# Altium project PCB_Project1.PrjPCB
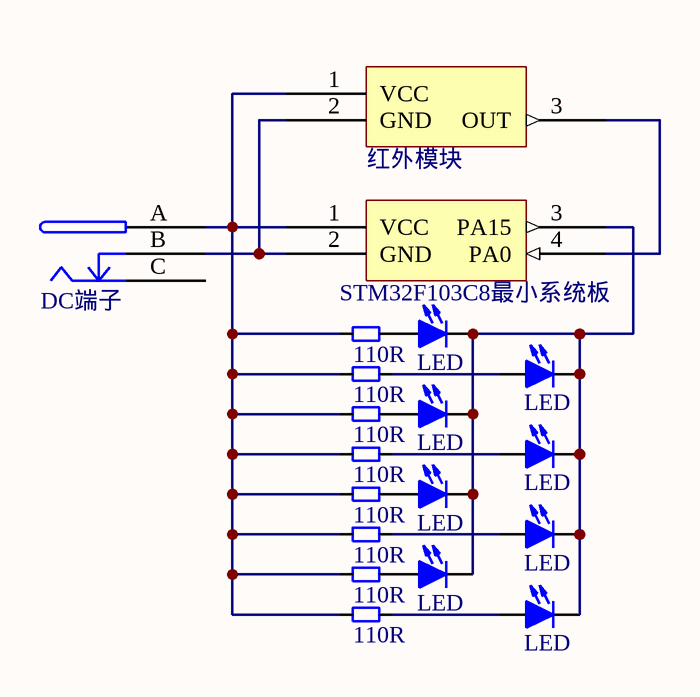
[diagram p0: Sheet1.SchDoc]
1 sheet, 19 parts. Net scope: global (net labels, ports and power ports of the same name join across sheets).

## Sheet Sheet1.SchDoc
size A4

### Parts
(Parts that share a designator on the sheet are numbered #1, #2 ... from top to bottom, then left to right.)
#1  红外模块
#2  STM32F103C8最小系统板
?#1  DC端子
?#2  110R
?#3  LED  [3mmLED白色]
?#4  110R
?#5  LED  [3mmLED白色]
?#6  110R
?#7  LED  [3mmLED白色]
?#8  110R
?#9  LED  [3mmLED白色]
?#10  110R
?#11  LED  [3mmLED白色]
?#12  110R
?#13  LED  [3mmLED白色]
?#14  110R
?#15  LED  [3mmLED白色]
?#16  110R
?#17  LED  [3mmLED白色]

### Nets
Net#1_1: #1.1(VCC) #2.1(VCC) ?#1.A ?#2.?1 ?#4.?1 ?#6.?1 ?#8.?1 ?#10.?1 ?#12.?1 ?#14.?1 ?#16.?1
Net#1_2: #1.2(GND) #2.2(GND) ?#1.B
Net#1_3: #1.3(OUT) #2.4(PA0)
Net#2_3: #2.3(PA15) ?#3.2(K) ?#5.2(K) ?#7.2(K) ?#9.2(K) ?#11.2(K) ?#13.2(K) ?#15.2(K) ?#17.2(K)
Net?#2_?2: ?#2.?2 ?#3.1(A)
Net?#4_?2: ?#4.?2 ?#5.1(A)
Net?#6_?2: ?#6.?2 ?#7.1(A)
Net?#8_?2: ?#8.?2 ?#9.1(A)
Net?#10_?2: ?#10.?2 ?#11.1(A)
Net?#12_?2: ?#12.?2 ?#13.1(A)
Net?#14_?2: ?#14.?2 ?#15.1(A)
Net?#16_?2: ?#16.?2 ?#17.1(A)

Not connected (* = marked no-connect by the designer): ?#1 C

### Library data of the parts
#2 = 系统板
?#1 = Component_2
?#2 ?#4 ?#6 ?#8 ?#10 ?#12 ?#14 ?#16 = 电阻
?#3 ?#5 ?#7 ?#9 ?#11 ?#13 ?#15 ?#17 = 直插LED